# EAGLE design pre (EAGLE 9.3.0)
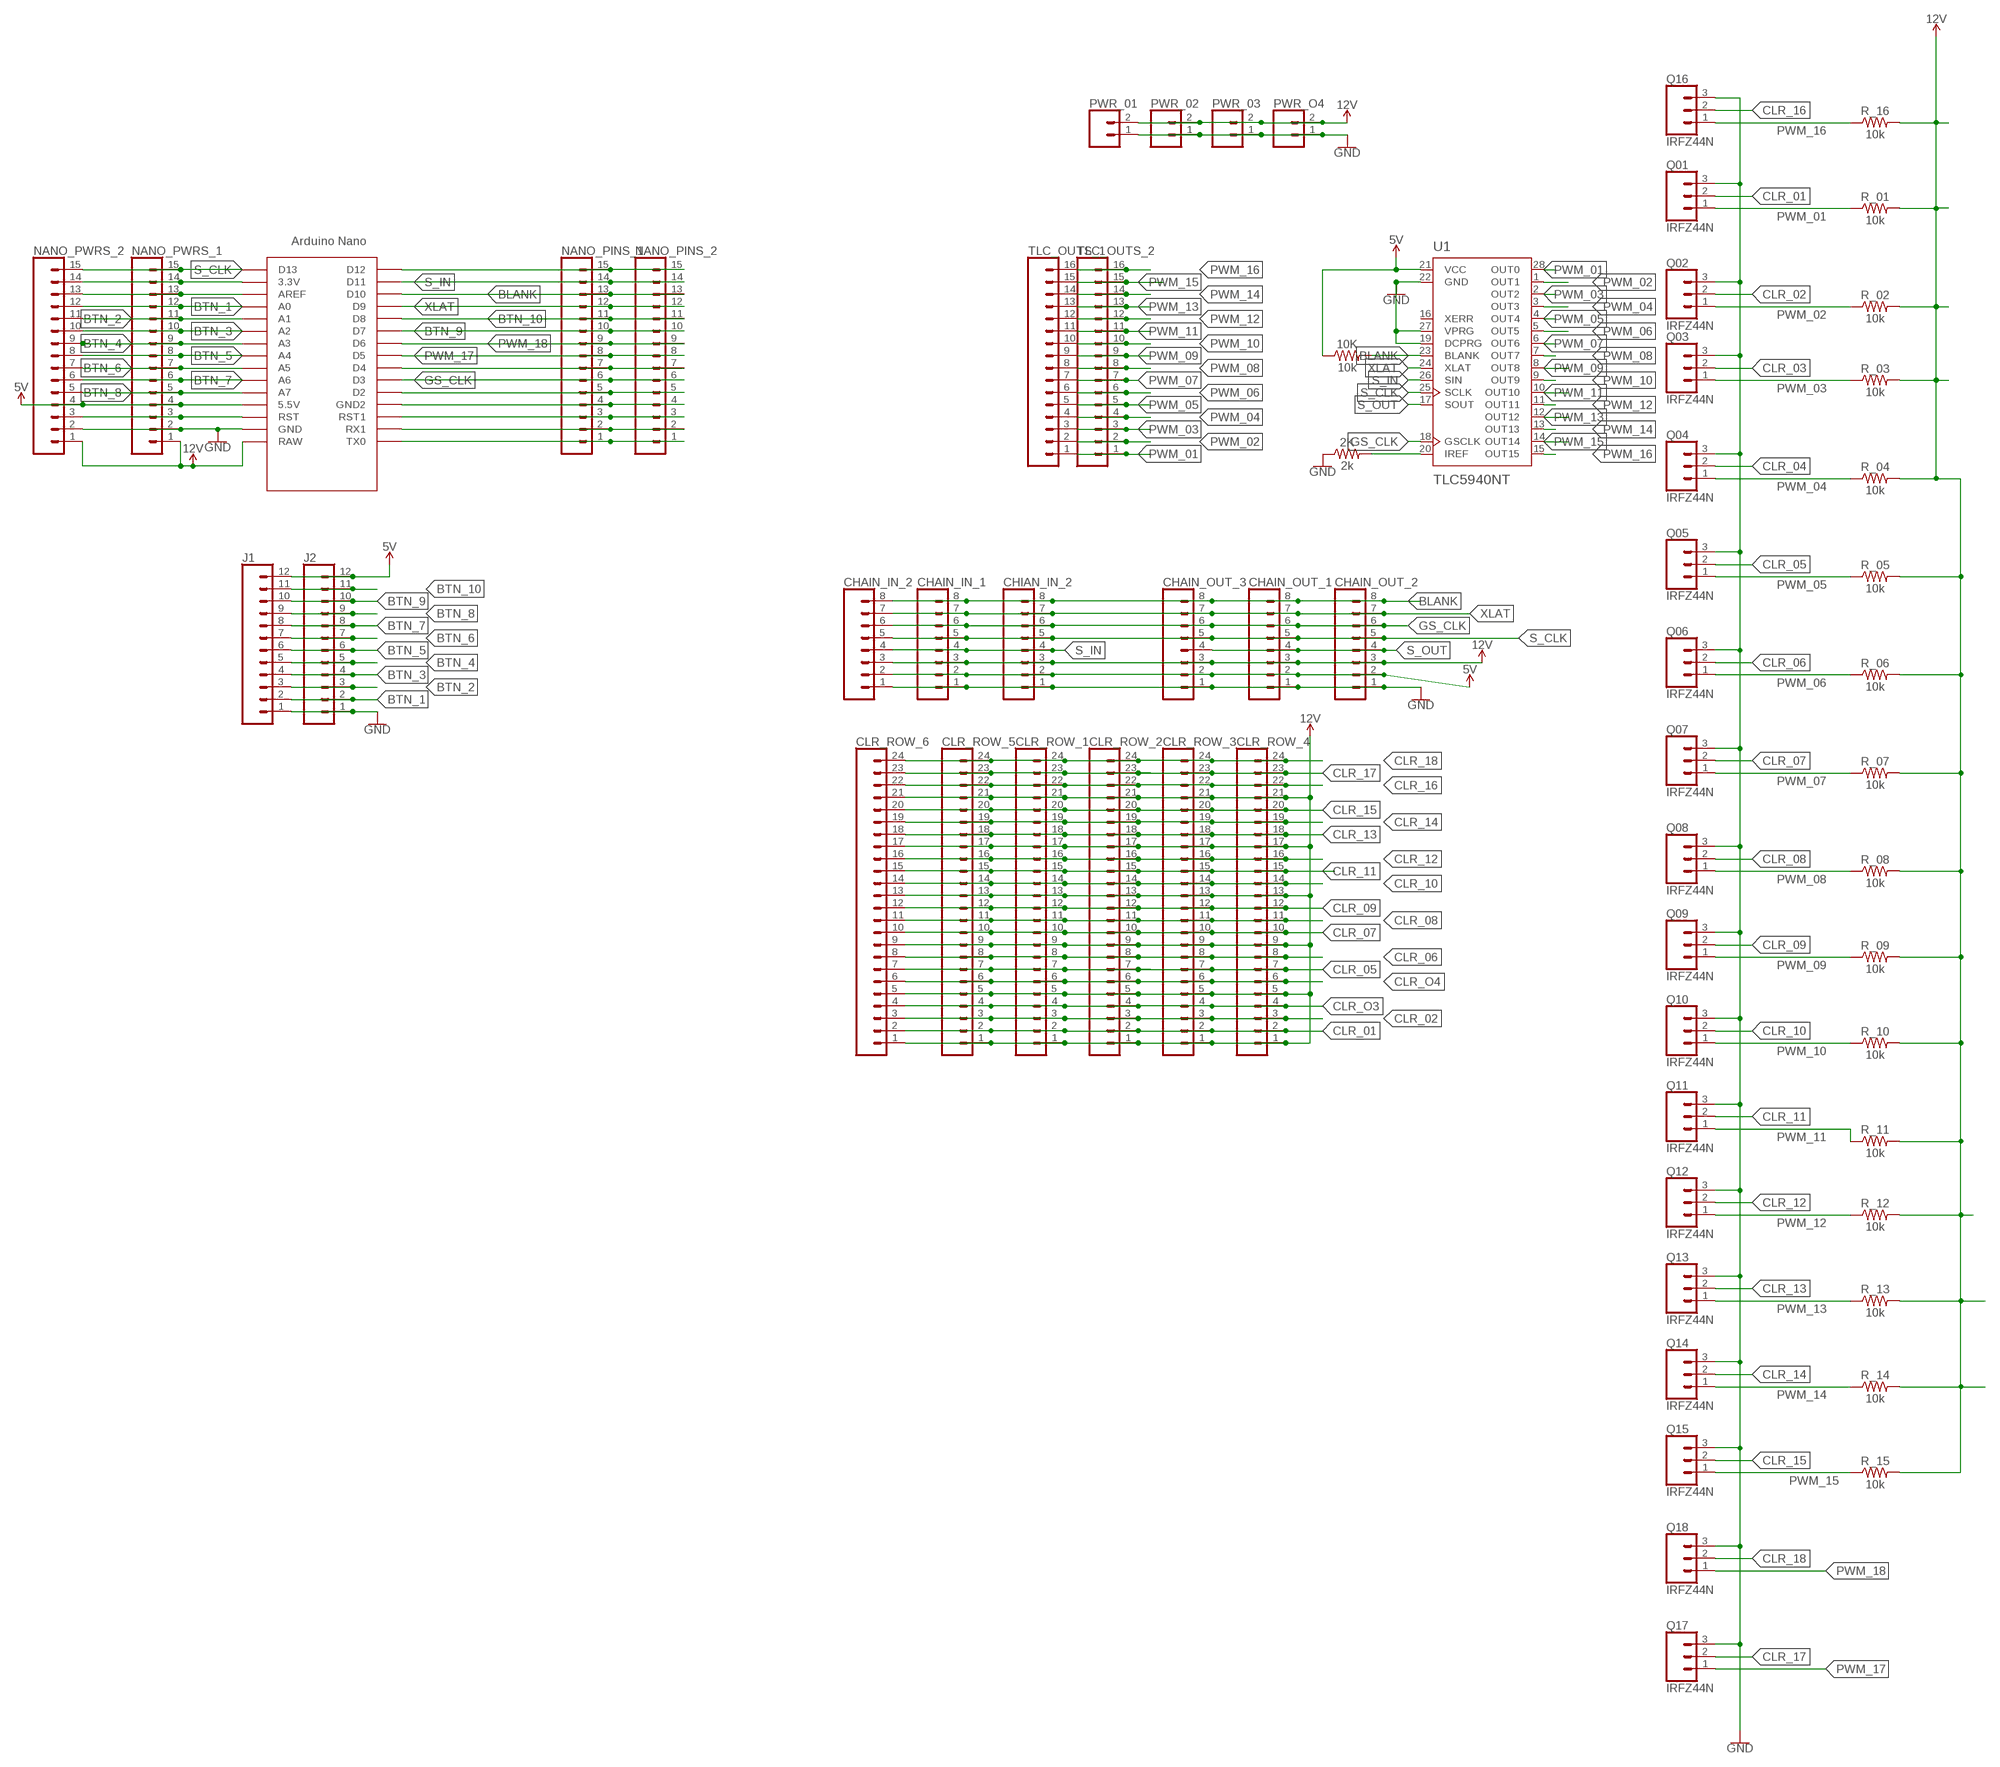
[diagram p0: schematic, sheet 1]

## Parts
2K  2k  10OHM-HORIZ-1/4W-1%  [AXIAL-0.3]
10K  10k  10KOHM-HORIZ-1/4W-1%  [AXIAL-0.3]
CHAIN_IN_1  CONN_08"  [1X08]
CHAIN_IN_2  CONN_08"  [1X08]
CHAIN_OUT_1  CONN_08"  [1X08]
CHAIN_OUT_2  CONN_08"  [1X08]
CHAIN_OUT_3  CONN_08"  [1X08]
CHIAN_IN_2  CONN_08"  [1X08]
CLR_ROW_1  CONN_24  [1X24]
CLR_ROW_2  CONN_24  [1X24]
CLR_ROW_3  CONN_24  [1X24]
CLR_ROW_4  CONN_24  [1X24]
CLR_ROW_5  CONN_24  [1X24]
CLR_ROW_6  CONN_24  [1X24]
J1  CONN_12  [1X12]
J2  CONN_12  [1X12]
NANO_PINS_1  CONN_15  [1X15]
NANO_PINS_2  CONN_15  [1X15]
NANO_PWRS_1  CONN_15  [1X15]
NANO_PWRS_2  CONN_15  [1X15]
PWR_01  CONN_023.5MM  [SCREWTERMINAL-3.5MM-2]
PWR_02  CONN_023.5MM  [SCREWTERMINAL-3.5MM-2]
PWR_03  CONN_02  [1X02]
PWR_O4  CONN_02  [1X02]
Q01  IRFZ44N  CONN_03  [1X03]
Q02  IRFZ44N  CONN_03  [1X03]
Q03  IRFZ44N  CONN_03  [1X03]
Q04  IRFZ44N  CONN_03  [1X03]
Q05  IRFZ44N  CONN_03  [1X03]
Q06  IRFZ44N  CONN_03  [1X03]
Q07  IRFZ44N  CONN_03  [1X03]
Q08  IRFZ44N  CONN_03  [1X03]
Q09  IRFZ44N  CONN_03  [1X03]
Q10  IRFZ44N  CONN_03  [1X03]
Q11  IRFZ44N  CONN_03  [1X03]
Q12  IRFZ44N  CONN_03  [1X03]
Q13  IRFZ44N  CONN_03  [1X03]
Q14  IRFZ44N  CONN_03  [1X03]
Q15  IRFZ44N  CONN_03  [1X03]
Q16  IRFZ44N  CONN_03  [1X03]
Q17  IRFZ44N  CONN_03  [1X03]
Q18  IRFZ44N  CONN_03  [1X03]
R_01  10k  10KOHM-HORIZ-1/4W-1%  [AXIAL-0.3]
R_02  10k  10KOHM-HORIZ-1/4W-1%  [AXIAL-0.3]
R_03  10k  10KOHM-HORIZ-1/4W-1%  [AXIAL-0.3]
R_04  10k  10KOHM-HORIZ-1/4W-1%  [AXIAL-0.3]
R_05  10k  10KOHM-HORIZ-1/4W-1%  [AXIAL-0.3]
R_06  10k  10KOHM-HORIZ-1/4W-1%  [AXIAL-0.3]
R_07  10k  10KOHM-HORIZ-1/4W-1%  [AXIAL-0.3]
R_08  10k  10KOHM-HORIZ-1/4W-1%  [AXIAL-0.3]
R_09  10k  10KOHM-HORIZ-1/4W-1%  [AXIAL-0.3]
R_10  10k  10KOHM-HORIZ-1/4W-1%  [AXIAL-0.3]
R_11  10k  10KOHM-HORIZ-1/4W-1%  [AXIAL-0.3]
R_12  10k  10KOHM-HORIZ-1/4W-1%  [AXIAL-0.3]
R_13  10k  10KOHM-HORIZ-1/4W-1%  [AXIAL-0.3]
R_14  10k  10KOHM-HORIZ-1/4W-1%  [AXIAL-0.3]
R_15  10k  10KOHM-HORIZ-1/4W-1%  [AXIAL-0.3]
R_16  10k  10KOHM-HORIZ-1/4W-1%  [AXIAL-0.3]
TLC_OUTS_1  CONN_16  [1X16]
TLC_OUTS_2  CONN_16  [1X16]
U1  TLC5940NT  [DIL28-3]
U$1  NANO  [NANO]

## Nets
5V: 10K.P$1 CHAIN_IN_1.2 CHAIN_IN_2.2 CHAIN_OUT_1.2 CHAIN_OUT_2.2 CHAIN_OUT_3.2 CHIAN_IN_2.2 J1.12 J2.12 NANO_PWRS_1.4 NANO_PWRS_2.4 U1.21(VCC) U$1.5V(5.5V)
12V: CHAIN_IN_1.3 CHAIN_IN_2.3 CHAIN_OUT_1.3 CHAIN_OUT_2.3 CHAIN_OUT_3.3 CHIAN_IN_2.3 CLR_ROW_1.1 CLR_ROW_1.5 CLR_ROW_1.9 CLR_ROW_1.13 CLR_ROW_1.17 CLR_ROW_1.21 CLR_ROW_2.1 CLR_ROW_2.5 CLR_ROW_2.9 CLR_ROW_2.13 CLR_ROW_2.17 CLR_ROW_2.21 CLR_ROW_3.1 CLR_ROW_3.5 CLR_ROW_3.9 CLR_ROW_3.13 CLR_ROW_3.17 CLR_ROW_3.21 CLR_ROW_4.1 CLR_ROW_4.5 CLR_ROW_4.9 CLR_ROW_4.13 CLR_ROW_4.17 CLR_ROW_4.21 CLR_ROW_5.1 CLR_ROW_5.5 CLR_ROW_5.9 CLR_ROW_5.13 CLR_ROW_5.17 CLR_ROW_5.21 CLR_ROW_6.1 CLR_ROW_6.5 CLR_ROW_6.9 CLR_ROW_6.13 CLR_ROW_6.17 CLR_ROW_6.21 NANO_PWRS_1.1 NANO_PWRS_2.1 PWR_01.2 PWR_02.2 PWR_03.2 PWR_O4.2 R_01.P$2 R_02.P$2 R_03.P$2 R_04.P$2 R_05.P$2 R_06.P$2 R_07.P$2 R_08.P$2 R_09.P$2 R_10.P$2 R_11.P$2 R_12.P$2 R_13.P$2 R_14.P$2 R_15.P$2 R_16.P$2 U$1.RAW
BLANK: 10K.P$2 CHAIN_IN_1.8 CHAIN_IN_2.8 CHAIN_OUT_1.8 CHAIN_OUT_2.8 CHAIN_OUT_3.8 CHIAN_IN_2.8 NANO_PINS_1.13 NANO_PINS_2.13 U1.23(BLANK) U$1.D10
BTN_1: J1.2 J2.2 NANO_PWRS_1.12 NANO_PWRS_2.12 U$1.A0
BTN_2: J1.3 J2.3 NANO_PWRS_1.11 NANO_PWRS_2.11 U$1.A1
BTN_3: J1.4 J2.4 NANO_PWRS_1.10 NANO_PWRS_2.10 U$1.A2
BTN_4: J1.5 J2.5 NANO_PWRS_1.9 NANO_PWRS_2.9 U$1.A3
BTN_5: J1.6 J2.6 NANO_PWRS_1.8 NANO_PWRS_2.8 U$1.A4
BTN_6: J1.7 J2.7 NANO_PWRS_1.7 NANO_PWRS_2.7 U$1.A5
BTN_7: J1.8 J2.8 NANO_PWRS_1.6 NANO_PWRS_2.6 U$1.A6
BTN_8: J1.9 J2.9 NANO_PWRS_1.5 NANO_PWRS_2.5 U$1.A7
BTN_9: J1.10 J2.10 NANO_PINS_1.10 NANO_PINS_2.10 U$1.D7
BTN_10: J1.11 J2.11 NANO_PINS_1.11 NANO_PINS_2.11 U$1.D8
CLR_01: CLR_ROW_1.2 CLR_ROW_2.2 CLR_ROW_3.2 CLR_ROW_4.2 CLR_ROW_5.2 CLR_ROW_6.2 Q01.2
CLR_02: CLR_ROW_1.3 CLR_ROW_2.3 CLR_ROW_3.3 CLR_ROW_4.3 CLR_ROW_5.3 CLR_ROW_6.3 Q02.2
CLR_03: Q03.2
CLR_04: Q04.2
CLR_05: CLR_ROW_1.7 CLR_ROW_2.7 CLR_ROW_3.7 CLR_ROW_4.7 CLR_ROW_5.7 CLR_ROW_6.7 Q05.2
CLR_06: CLR_ROW_1.8 CLR_ROW_2.8 CLR_ROW_3.8 CLR_ROW_4.8 CLR_ROW_5.8 CLR_ROW_6.8 Q06.2
CLR_07: CLR_ROW_1.10 CLR_ROW_2.10 CLR_ROW_3.10 CLR_ROW_4.10 CLR_ROW_5.10 CLR_ROW_6.10 Q07.2
CLR_08: CLR_ROW_1.11 CLR_ROW_2.11 CLR_ROW_3.11 CLR_ROW_4.11 CLR_ROW_5.11 CLR_ROW_6.11 Q08.2
CLR_09: CLR_ROW_1.12 CLR_ROW_2.12 CLR_ROW_3.12 CLR_ROW_4.12 CLR_ROW_5.12 CLR_ROW_6.12 Q09.2
CLR_10: CLR_ROW_1.14 CLR_ROW_2.14 CLR_ROW_3.14 CLR_ROW_4.14 CLR_ROW_5.14 CLR_ROW_6.14 Q10.2
CLR_11: CLR_ROW_1.15 CLR_ROW_2.15 CLR_ROW_3.15 CLR_ROW_4.15 CLR_ROW_5.15 CLR_ROW_6.15 Q11.2
CLR_12: CLR_ROW_1.16 CLR_ROW_2.16 CLR_ROW_3.16 CLR_ROW_4.16 CLR_ROW_5.16 CLR_ROW_6.16 Q12.2
CLR_13: CLR_ROW_1.18 CLR_ROW_2.18 CLR_ROW_3.18 CLR_ROW_4.18 CLR_ROW_5.18 CLR_ROW_6.18 Q13.2
CLR_14: CLR_ROW_1.19 CLR_ROW_2.19 CLR_ROW_3.19 CLR_ROW_4.19 CLR_ROW_5.19 CLR_ROW_6.19 Q14.2
CLR_15: CLR_ROW_1.20 CLR_ROW_2.20 CLR_ROW_3.20 CLR_ROW_4.20 CLR_ROW_5.20 CLR_ROW_6.20 Q15.2
CLR_16: CLR_ROW_1.22 CLR_ROW_2.22 CLR_ROW_3.22 CLR_ROW_4.22 CLR_ROW_5.22 CLR_ROW_6.22 Q16.2
CLR_17: CLR_ROW_1.23 CLR_ROW_2.23 CLR_ROW_3.23 CLR_ROW_4.23 CLR_ROW_5.23 CLR_ROW_6.23 Q17.2
CLR_18: CLR_ROW_1.24 CLR_ROW_2.24 CLR_ROW_3.24 CLR_ROW_4.24 CLR_ROW_5.24 CLR_ROW_6.24 Q18.2
CLR_O3: CLR_ROW_1.4 CLR_ROW_2.4 CLR_ROW_3.4 CLR_ROW_4.4 CLR_ROW_5.4 CLR_ROW_6.4
CLR_O4: CLR_ROW_1.6 CLR_ROW_2.6 CLR_ROW_3.6 CLR_ROW_4.6 CLR_ROW_5.6 CLR_ROW_6.6
GND: 2K.P$1 CHAIN_IN_1.1 CHAIN_IN_2.1 CHAIN_OUT_1.1 CHAIN_OUT_2.1 CHAIN_OUT_3.1 CHIAN_IN_2.1 J1.1 J2.1 NANO_PINS_1.4 NANO_PINS_2.4 NANO_PWRS_1.2 NANO_PWRS_2.2 PWR_01.1 PWR_02.1 PWR_03.1 PWR_O4.1 Q01.3 Q02.3 Q03.3 Q04.3 Q05.3 Q06.3 Q07.3 Q08.3 Q09.3 Q10.3 Q11.3 Q12.3 Q13.3 Q14.3 Q15.3 Q16.3 Q17.3 Q18.3 U1.19(DCPRG) U1.22(GND) U1.27(VPRG) U$1.GND U$1.GND1(GND2)
GS_CLK: CHAIN_IN_1.6 CHAIN_IN_2.6 CHAIN_OUT_1.6 CHAIN_OUT_2.6 CHAIN_OUT_3.6 CHIAN_IN_2.6 NANO_PINS_1.6 NANO_PINS_2.6 U1.18(GSCLK) U$1.D3
N$1: 2K.P$2 U1.20(IREF)
N$3: NANO_PWRS_1.14 NANO_PWRS_2.14 U$1.3.3V
N$4: NANO_PWRS_1.13 NANO_PWRS_2.13 U$1.AREF
N$13: NANO_PWRS_1.3 NANO_PWRS_2.3 U$1.RST
N$14: NANO_PINS_1.15 NANO_PINS_2.15 U$1.D12
N$16: NANO_PINS_1.3 NANO_PINS_2.3 U$1.RST1
N$19: NANO_PINS_1.2 NANO_PINS_2.2 U$1.RX1
N$20: NANO_PINS_1.7 NANO_PINS_2.7 U$1.D4
N$21: NANO_PINS_1.1 NANO_PINS_2.1 U$1.TX0
N$22: NANO_PINS_1.5 NANO_PINS_2.5 U$1.D2
PWM_01: Q01.1 R_01.P$1 TLC_OUTS_1.1 TLC_OUTS_2.1 U1.28(OUT0)
PWM_02: Q02.1 R_02.P$1 TLC_OUTS_1.2 TLC_OUTS_2.2 U1.1(OUT1)
PWM_03: Q03.1 R_03.P$1 TLC_OUTS_1.3 TLC_OUTS_2.3 U1.2(OUT2)
PWM_04: Q04.1 R_04.P$1 TLC_OUTS_1.4 TLC_OUTS_2.4 U1.3(OUT3)
PWM_05: Q05.1 R_05.P$1 TLC_OUTS_1.5 TLC_OUTS_2.5 U1.4(OUT4)
PWM_06: Q06.1 R_06.P$1 TLC_OUTS_1.6 TLC_OUTS_2.6 U1.5(OUT5)
PWM_07: Q07.1 R_07.P$1 TLC_OUTS_1.7 TLC_OUTS_2.7 U1.6(OUT6)
PWM_08: Q08.1 R_08.P$1 TLC_OUTS_1.8 TLC_OUTS_2.8 U1.7(OUT7)
PWM_09: Q09.1 R_09.P$1 TLC_OUTS_1.9 TLC_OUTS_2.9 U1.8(OUT8)
PWM_10: Q10.1 R_10.P$1 TLC_OUTS_1.10 TLC_OUTS_2.10 U1.9(OUT9)
PWM_11: Q11.1 R_11.P$1 TLC_OUTS_1.11 TLC_OUTS_2.11 U1.10(OUT10)
PWM_12: Q12.1 R_12.P$1 TLC_OUTS_1.12 TLC_OUTS_2.12 U1.11(OUT11)
PWM_13: Q13.1 R_13.P$1 TLC_OUTS_1.13 TLC_OUTS_2.13 U1.12(OUT12)
PWM_14: Q14.1 R_14.P$1 TLC_OUTS_1.14 TLC_OUTS_2.14 U1.13(OUT13)
PWM_15: Q15.1 R_15.P$1 TLC_OUTS_1.15 TLC_OUTS_2.15 U1.14(OUT14)
PWM_16: Q16.1 R_16.P$1 TLC_OUTS_1.16 TLC_OUTS_2.16 U1.15(OUT15)
PWM_17: NANO_PINS_1.8 NANO_PINS_2.8 Q17.1 U$1.D5
PWM_18: NANO_PINS_1.9 NANO_PINS_2.9 Q18.1 U$1.D6
S_CLK: CHAIN_IN_1.5 CHAIN_IN_2.5 CHAIN_OUT_1.5 CHAIN_OUT_2.5 CHAIN_OUT_3.5 CHIAN_IN_2.5 NANO_PWRS_1.15 NANO_PWRS_2.15 U1.25(SCLK) U$1.D13
S_IN: CHAIN_IN_1.4 CHAIN_IN_2.4 CHIAN_IN_2.4 NANO_PINS_1.14 NANO_PINS_2.14 U1.26(SIN) U$1.D11
S_OUT: CHAIN_OUT_1.4 CHAIN_OUT_2.4 CHAIN_OUT_3.4 U1.17(SOUT)
XLAT: CHAIN_IN_1.7 CHAIN_IN_2.7 CHAIN_OUT_1.7 CHAIN_OUT_2.7 CHAIN_OUT_3.7 CHIAN_IN_2.7 NANO_PINS_1.12 NANO_PINS_2.12 U1.24(XLAT) U$1.D9
Unconnected: U1.16(XERR) U$1.ICSP1 U$1.ICSP2 U$1.ICSP3 U$1.ICSP4 U$1.ICSP5 U$1.ICSP6

## Library data of the parts
2K = SparkFun-Resistors:10OHM: 10Ω resistor A resistor is a passive two-terminal electrical component that implements electrical resistance as a circuit element. Resistors act to reduce current flow, and, at the same time, act to lower voltage levels within circuits. - Wikipedia; PROD_ID: RES-12180; VALUE: 10
10K R_01-R_09 R_10-R_16 = SparkFun-Resistors:10KOHM: 10kΩ resistor A resistor is a passive two-terminal electrical component that implements electrical resistance as a circuit element. Resistors act to reduce current flow, and, at the same time, act to lower voltage levels within circuits. - Wikipedia; PROD_ID: RES-12183
CHAIN_IN_1 CHAIN_IN_2 CHAIN_OUT_1-CHAIN_OUT_3 CHIAN_IN_2 = SparkFun-Connectors:CONN_08: Multi connection point. Often used as Generic Header-pin footprint for 0.1 inch spaced/style header connections On any of the 0.1 inch spaced packages, you can populate with these: Break Away Headers - Straight <https://www.sparkfun.com/products/116> (PRT-00116) Break Away Male Headers - Right Angle <https://www.sparkfun.com/products/553> (PRT-00553) Female Headers <https://www.sparkfun.com/products/115> (PRT-00115) Break Away Headers - Machine Pin <https://www.sparkfun.com/products/117> (PRT-00117) Break Away Female Headers - Swiss Machine Pin <https://www.sparkfun.com/products/743> (PRT-00743) Arduino Stackable Header - 8 Pin <https://www.sparkfun.com/products/9279> (PRT-09279) For SCREWTERMINALS and SPRING TERMINALS visit here: Screw Terimnals on SparkFun.com <https://www.sparkfun.com/search/results?term=Screw+Terminals> (5mm/3.5mm/2.54mm spacing) This device is also useful as a general connection point to wire up your design to another part of your project. Our various solder wires solder well into these plated through hole pads. Hook-Up Wire - Assortment (Stranded, 22 AWG) <https://www.sparkfun.com/products/11375> (PRT-11375) Hook-Up Wire - Assortment (Solid Core, 22 AWG) <https://www.sparkfun.com/products/11367> (PRT-11367) View the entire wire category on our website here <https://www.sparkfun.com/categories/141> Special notes: Molex polarized connector foot print use with SKU : PRT-08231 with associated crimp pins and housings. 1MM SMD Version SKU: PRT-10208 NOTES ON THE VARIANTS LOCK and LOCK_LONGPADS... This footprint was designed to help hold the alignment of a through-hole component (i.e. 6-pin header) while soldering it into place. You may notice that each hole has been shifted either up or down by 0.005 of an inch from it's more standard position (which is a perfectly straight line). This slight alteration caused the pins (the squares in the middle) to touch the edges of the holes. Because they are alternating, it causes a "brace" to hold the component in place. 0.005 has proven to be the perfect amount of "off-center" position when using our standard breakaway headers. Although looks a little odd when you look at the bare footprint, once you have a header in there, the alteration is very hard to notice. Also,if you push a header all the way into place, it is covered up entirely on the bottom side.; PROD_ID: CONN-08438
CLR_ROW_1-CLR_ROW_6 = SparkFun-Connectors:CONN_24: Multi connection point. Often used as Generic Header-pin footprint for 0.1 inch spaced/style header connections On any of the 0.1 inch spaced packages, you can populate with these: Break Away Headers - Straight <https://www.sparkfun.com/products/116> (PRT-00116) Break Away Male Headers - Right Angle <https://www.sparkfun.com/products/553> (PRT-00553) Female Headers <https://www.sparkfun.com/products/115> (PRT-00115) Break Away Headers - Machine Pin <https://www.sparkfun.com/products/117> (PRT-00117) Break Away Female Headers - Swiss Machine Pin <https://www.sparkfun.com/products/743> (PRT-00743) For SCREWTERMINALS and SPRING TERMINALS visit here: Screw Terimnals on SparkFun.com <https://www.sparkfun.com/search/results?term=Screw+Terminals> (5mm/3.5mm/2.54mm spacing) This device is also useful as a general connection point to wire up your design to another part of your project. Our various solder wires solder well into these plated through hole pads. Hook-Up Wire - Assortment (Stranded, 22 AWG) <https://www.sparkfun.com/products/11375> (PRT-11375) Hook-Up Wire - Assortment (Solid Core, 22 AWG) <https://www.sparkfun.com/products/11367> (PRT-11367) View the entire wire category on our website here <https://www.sparkfun.com/categories/141> Special notes: Molex polarized connector foot print use with SKU : PRT-08231 with associated crimp pins and housings. 1MM SMD Version SKU: PRT-10208 NOTES ON THE VARIANTS LOCK and LOCK_LONGPADS... This footprint was designed to help hold the alignment of a through-hole component (i.e. 6-pin header) while soldering it into place. You may notice that each hole has been shifted either up or down by 0.005 of an inch from it's more standard position (which is a perfectly straight line). This slight alteration caused the pins (the squares in the middle) to touch the edges of the holes. Because they are alternating, it causes a "brace" to hold the component in place. 0.005 has proven to be the perfect amount of "off-center" position when using our standard breakaway headers. Although looks a little odd when you look at the bare footprint, once you have a header in there, the alteration is very hard to notice. Also,if you push a header all the way into place, it is covered up entirely on the bottom side.
J1 J2 = SparkFun-Connectors:CONN_12: Multi connection point. Often used as Generic Header-pin footprint for 0.1 inch spaced/style header connections On any of the 0.1 inch spaced packages, you can populate with these: Break Away Headers - Straight <https://www.sparkfun.com/products/116> (PRT-00116) Break Away Male Headers - Right Angle <https://www.sparkfun.com/products/553> (PRT-00553) Female Headers <https://www.sparkfun.com/products/115> (PRT-00115) Break Away Headers - Machine Pin <https://www.sparkfun.com/products/117> (PRT-00117) Break Away Female Headers - Swiss Machine Pin <https://www.sparkfun.com/products/743> (PRT-00743) For SCREWTERMINALS and SPRING TERMINALS visit here: Screw Terimnals on SparkFun.com <https://www.sparkfun.com/search/results?term=Screw+Terminals> (5mm/3.5mm/2.54mm spacing) This device is also useful as a general connection point to wire up your design to another part of your project. Our various solder wires solder well into these plated through hole pads. Hook-Up Wire - Assortment (Stranded, 22 AWG) <https://www.sparkfun.com/products/11375> (PRT-11375) Hook-Up Wire - Assortment (Solid Core, 22 AWG) <https://www.sparkfun.com/products/11367> (PRT-11367) View the entire wire category on our website here <https://www.sparkfun.com/categories/141> Special notes: Molex polarized connector foot print use with SKU : PRT-08231 with associated crimp pins and housings. 1MM SMD Version SKU: PRT-10208 NOTES ON THE VARIANTS LOCK and LOCK_LONGPADS... This footprint was designed to help hold the alignment of a through-hole component (i.e. 6-pin header) while soldering it into place. You may notice that each hole has been shifted either up or down by 0.005 of an inch from it's more standard position (which is a perfectly straight line). This slight alteration caused the pins (the squares in the middle) to touch the edges of the holes. Because they are alternating, it causes a "brace" to hold the component in place. 0.005 has proven to be the perfect amount of "off-center" position when using our standard breakaway headers. Although looks a little odd when you look at the bare footprint, once you have a header in there, the alteration is very hard to notice. Also,if you push a header all the way into place, it is covered up entirely on the bottom side.
NANO_PINS_1 NANO_PINS_2 NANO_PWRS_1 NANO_PWRS_2 = SparkFun-Connectors:CONN_15: Multi connection point. Often used as Generic Header-pin footprint for 0.1 inch spaced/style header connections On any of the 0.1 inch spaced packages, you can populate with these: Break Away Headers - Straight <https://www.sparkfun.com/products/116> (PRT-00116) Break Away Male Headers - Right Angle <https://www.sparkfun.com/products/553> (PRT-00553) Female Headers <https://www.sparkfun.com/products/115> (PRT-00115) Break Away Headers - Machine Pin <https://www.sparkfun.com/products/117> (PRT-00117) Break Away Female Headers - Swiss Machine Pin <https://www.sparkfun.com/products/743> (PRT-00743) For SCREWTERMINALS and SPRING TERMINALS visit here: Screw Terimnals on SparkFun.com <https://www.sparkfun.com/search/results?term=Screw+Terminals> (5mm/3.5mm/2.54mm spacing) This device is also useful as a general connection point to wire up your design to another part of your project. Our various solder wires solder well into these plated through hole pads. Hook-Up Wire - Assortment (Stranded, 22 AWG) <https://www.sparkfun.com/products/11375> (PRT-11375) Hook-Up Wire - Assortment (Solid Core, 22 AWG) <https://www.sparkfun.com/products/11367> (PRT-11367) View the entire wire category on our website here <https://www.sparkfun.com/categories/141> Special notes: Molex polarized connector foot print use with SKU : PRT-08231 with associated crimp pins and housings. 1MM SMD Version SKU: PRT-10208 NOTES ON THE VARIANTS LOCK and LOCK_LONGPADS... This footprint was designed to help hold the alignment of a through-hole component (i.e. 6-pin header) while soldering it into place. You may notice that each hole has been shifted either up or down by 0.005 of an inch from it's more standard position (which is a perfectly straight line). This slight alteration caused the pins (the squares in the middle) to touch the edges of the holes. Because they are alternating, it causes a "brace" to hold the component in place. 0.005 has proven to be the perfect amount of "off-center" position when using our standard breakaway headers. Although looks a little odd when you look at the bare footprint, once you have a header in there, the alteration is very hard to notice. Also,if you push a header all the way into place, it is covered up entirely on the bottom side.
PWR_01 PWR_02 = SparkFun-Connectors:CONN_02: Multi connection point. Often used as Generic Header-pin footprint for 0.1 inch spaced/style header connections On any of the 0.1 inch spaced packages, you can populate with these: Break Away Headers - Straight <https://www.sparkfun.com/products/116> (PRT-00116) Break Away Male Headers - Right Angle <https://www.sparkfun.com/products/553> (PRT-00553) Female Headers <https://www.sparkfun.com/products/115> (PRT-00115) Break Away Headers - Machine Pin <https://www.sparkfun.com/products/117> (PRT-00117) Break Away Female Headers - Swiss Machine Pin <https://www.sparkfun.com/products/743> (PRT-00743) For SCREWTERMINALS and SPRING TERMINALS visit here: Screw Terimnals on SparkFun.com <https://www.sparkfun.com/search/results?term=Screw+Terminals> (5mm/3.5mm/2.54mm spacing) This device is also useful as a general connection point to wire up your design to another part of your project. Our various solder wires solder well into these plated through hole pads. Hook-Up Wire - Assortment (Stranded, 22 AWG) <https://www.sparkfun.com/products/11375> (PRT-11375) Hook-Up Wire - Assortment (Solid Core, 22 AWG) <https://www.sparkfun.com/products/11367> (PRT-11367) View the entire wire category on our website here <https://www.sparkfun.com/categories/141> Special notes: Molex polarized connector foot print use with: PRT-08233 with associated crimp pins and housings. 2.54_SCREWTERM for use with PRT-10571. 3.5mm Screw Terminal footprints for PRT-08084 5mm Screw Terminal footprints for use with PRT-08432; PROD_ID: CONN-08399
PWR_03 PWR_O4 = SparkFun-Connectors:CONN_02: Multi connection point. Often used as Generic Header-pin footprint for 0.1 inch spaced/style header connections On any of the 0.1 inch spaced packages, you can populate with these: Break Away Headers - Straight <https://www.sparkfun.com/products/116> (PRT-00116) Break Away Male Headers - Right Angle <https://www.sparkfun.com/products/553> (PRT-00553) Female Headers <https://www.sparkfun.com/products/115> (PRT-00115) Break Away Headers - Machine Pin <https://www.sparkfun.com/products/117> (PRT-00117) Break Away Female Headers - Swiss Machine Pin <https://www.sparkfun.com/products/743> (PRT-00743) For SCREWTERMINALS and SPRING TERMINALS visit here: Screw Terimnals on SparkFun.com <https://www.sparkfun.com/search/results?term=Screw+Terminals> (5mm/3.5mm/2.54mm spacing) This device is also useful as a general connection point to wire up your design to another part of your project. Our various solder wires solder well into these plated through hole pads. Hook-Up Wire - Assortment (Stranded, 22 AWG) <https://www.sparkfun.com/products/11375> (PRT-11375) Hook-Up Wire - Assortment (Solid Core, 22 AWG) <https://www.sparkfun.com/products/11367> (PRT-11367) View the entire wire category on our website here <https://www.sparkfun.com/categories/141> Special notes: Molex polarized connector foot print use with: PRT-08233 with associated crimp pins and housings. 2.54_SCREWTERM for use with PRT-10571. 3.5mm Screw Terminal footprints for PRT-08084 5mm Screw Terminal footprints for use with PRT-08432
Q01-Q09 Q10-Q18 = SparkFun-Connectors:CONN_03: Multi connection point. Often used as Generic Header-pin footprint for 0.1 inch spaced/style header connections On any of the 0.1 inch spaced packages, you can populate with these: Break Away Headers - Straight <https://www.sparkfun.com/products/116> (PRT-00116) Break Away Male Headers - Right Angle <https://www.sparkfun.com/products/553> (PRT-00553) Female Headers <https://www.sparkfun.com/products/115> (PRT-00115) Break Away Headers - Machine Pin <https://www.sparkfun.com/products/117> (PRT-00117) Break Away Female Headers - Swiss Machine Pin <https://www.sparkfun.com/products/743> (PRT-00743) Stackable Header - 3 Pin (Female, 0.1") <https://www.sparkfun.com/products/13875> (PRT-13875) For SCREWTERMINALS and SPRING TERMINALS visit here: Screw Terimnals on SparkFun.com <https://www.sparkfun.com/search/results?term=Screw+Terminals> (5mm/3.5mm/2.54mm spacing) This device is also useful as a general connection point to wire up your design to another part of your project. Our various solder wires solder well into these plated through hole pads. Hook-Up Wire - Assortment (Stranded, 22 AWG) <https://www.sparkfun.com/products/11375> (PRT-11375) Hook-Up Wire - Assortment (Solid Core, 22 AWG) <https://www.sparkfun.com/products/11367> (PRT-11367) View the entire wire category on our website here <https://www.sparkfun.com/categories/141> Special notes: Molex polarized connector foot print use with SKU : PRT-08232 with associated crimp pins and housings.; PROD_ID: XXX-00000; VALUE: 455-1750-1-ND
TLC_OUTS_1 TLC_OUTS_2 = SparkFun-Connectors:CONN_16: Multi connection point. Often used as Generic Header-pin footprint for 0.1 inch spaced/style header connections On any of the 0.1 inch spaced packages, you can populate with these: Break Away Headers - Straight <https://www.sparkfun.com/products/116> (PRT-00116) Break Away Male Headers - Right Angle <https://www.sparkfun.com/products/553> (PRT-00553) Female Headers <https://www.sparkfun.com/products/115> (PRT-00115) Break Away Headers - Machine Pin <https://www.sparkfun.com/products/117> (PRT-00117) Break Away Female Headers - Swiss Machine Pin <https://www.sparkfun.com/products/743> (PRT-00743) For SCREWTERMINALS and SPRING TERMINALS visit here: Screw Terimnals on SparkFun.com <https://www.sparkfun.com/search/results?term=Screw+Terminals> (5mm/3.5mm/2.54mm spacing) This device is also useful as a general connection point to wire up your design to another part of your project. Our various solder wires solder well into these plated through hole pads. Hook-Up Wire - Assortment (Stranded, 22 AWG) <https://www.sparkfun.com/products/11375> (PRT-11375) Hook-Up Wire - Assortment (Solid Core, 22 AWG) <https://www.sparkfun.com/products/11367> (PRT-11367) View the entire wire category on our website here <https://www.sparkfun.com/categories/141> Special notes: Molex polarized connector foot print use with SKU : PRT-08231 with associated crimp pins and housings. 1MM SMD Version SKU: PRT-10208 NOTES ON THE VARIANTS LOCK and LOCK_LONGPADS... This footprint was designed to help hold the alignment of a through-hole component (i.e. 6-pin header) while soldering it into place. You may notice that each hole has been shifted either up or down by 0.005 of an inch from it's more standard position (which is a perfectly straight line). This slight alteration caused the pins (the squares in the middle) to touch the edges of the holes. Because they are alternating, it causes a "brace" to hold the component in place. 0.005 has proven to be the perfect amount of "off-center" position when using our standard breakaway headers. Although looks a little odd when you look at the bare footprint, once you have a header in there, the alteration is very hard to notice. Also,if you push a header all the way into place, it is covered up entirely on the bottom side.
U1 = tlc5940:TLC5940
U$1 = Arduino-clone:NANO: Arduino Nano

## Board
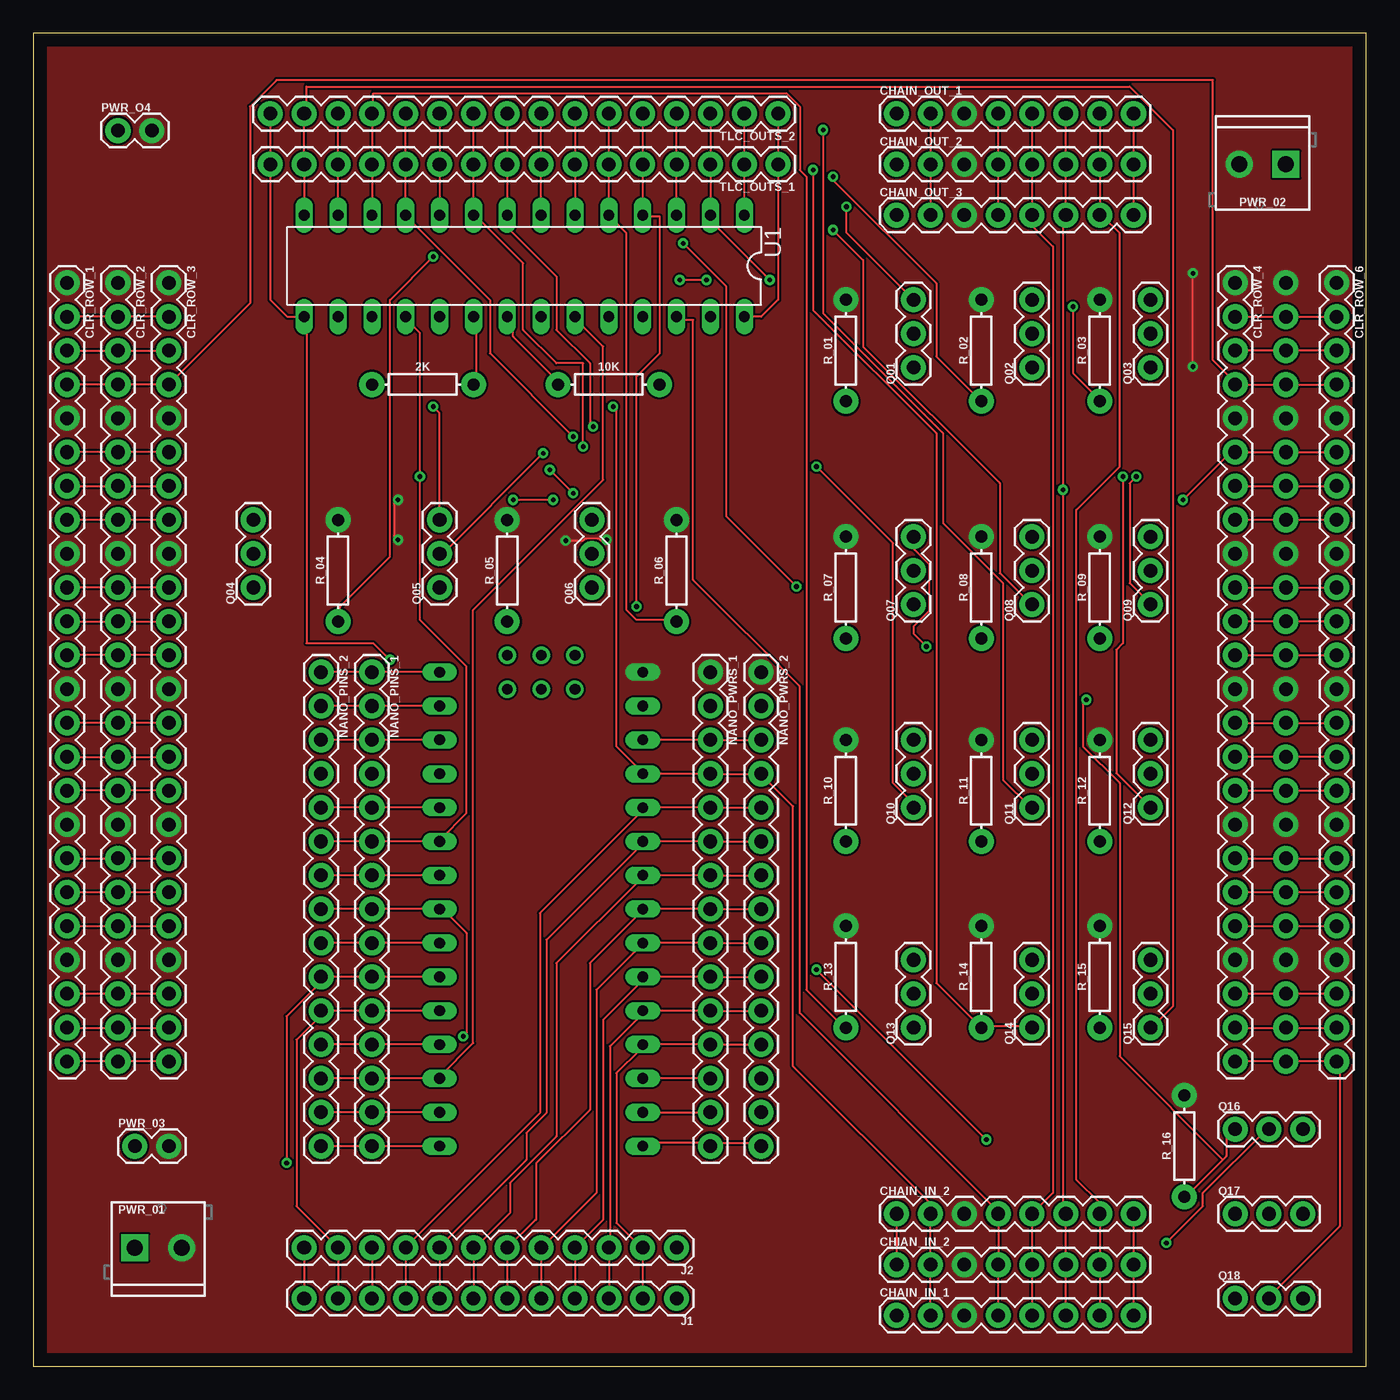
[diagram p1: board, top side]
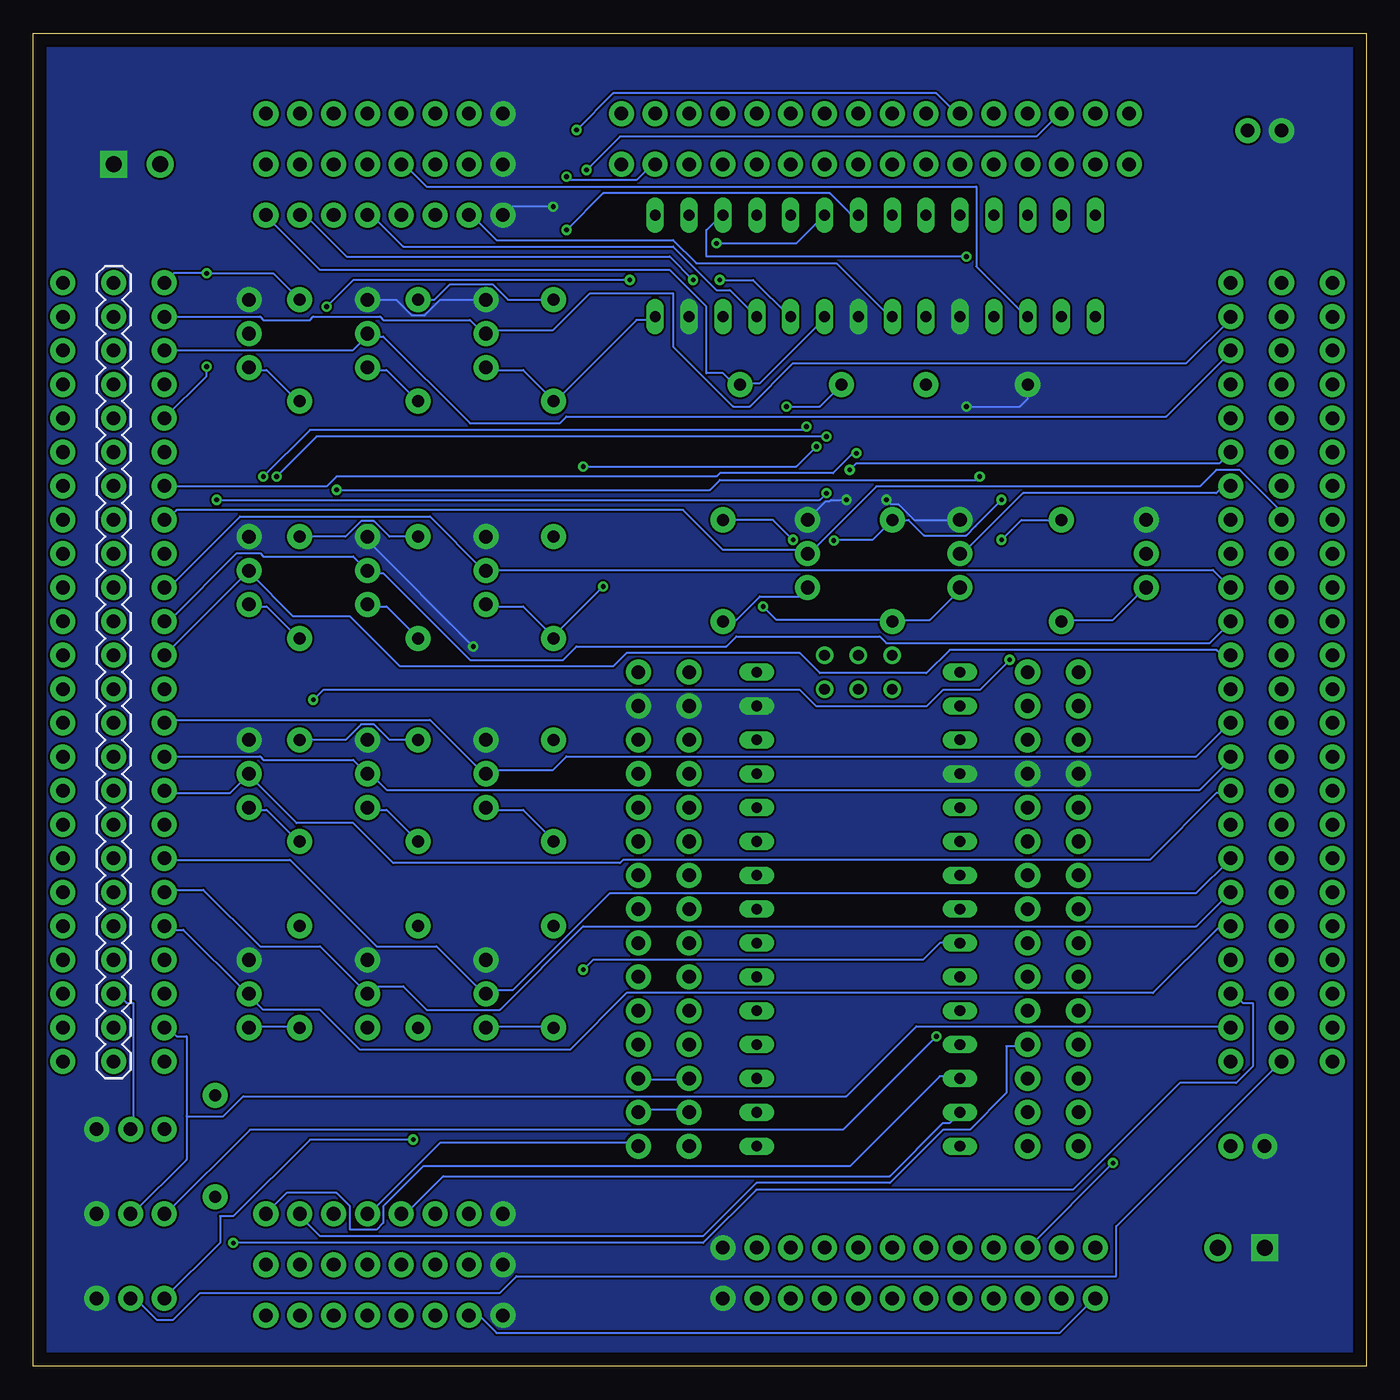
[diagram p2: board, bottom side, seen from below]

Size 100 x 100 mm. Coordinates in mm from the lower left corner, seen from the top.
Outline: 0,0 100,0 100,100 0,100 0,0
Copper layers (1*16): Top 0.035mm / dielectric 1.5mm / Bottom 0.035mm
Design rules "default": minimum track width 6mil, minimum drill 0.35mm, track to track 6mil, track to pad 6mil, pad to pad 6mil, via to via 6mil, smd to smd 6mil, copper to edge 40mil, drill to drill 6mil, minimum pad ring 10mil, minimum via ring 8mil, stop-mask expansion 4mil, vias tented up to drill 0mil, thermal gap 10mil

### Footprints (pad centres in the part's own frame; a part is rotated, then mirrored left to right if it is on the bottom)
AXIAL-0.3 = drill 0.9 pad 1.88: P$1 -3.81,0; P$2 3.81,0
1X08 = drill 1.016 pad 1.88: 1 0,0; 2 2.54,0; 3 5.08,0; 4 7.62,0; 5 10.16,0; 6 12.7,0; 7 15.24,0; 8 17.78,0
1X24 = drill 1.016 pad 1.88: 1 -26.67,0; 2 -24.13,0; 3 -21.59,0; 4 -19.05,0; 5 -16.51,0; 6 -13.97,0; 7 -11.43,0; 8 -8.89,0; 9 -6.35,0; 10 -3.81,0; 11 -1.27,0; 12 1.27,0; 13 3.81,0; 14 6.35,0; 15 8.89,0; 16 11.43,0; 17 13.97,0; 18 16.51,0; 19 19.05,0; 20 21.59,0; 21 24.13,0; 22 26.67,0; 23 29.21,0; 24 31.75,0
1X12 = drill 1.016 pad 1.88: 1 0,0; 2 2.54,0; 3 5.08,0; 4 7.62,0; 5 10.16,0; 6 12.7,0; 7 15.24,0; 8 17.78,0; 9 20.32,0; 10 22.86,0; 11 25.4,0; 12 27.94,0
1X15 = drill 1.016 pad 1.88: 1 0,0; 2 2.54,0; 3 5.08,0; 4 7.62,0; 5 10.16,0; 6 12.7,0; 7 15.24,0; 8 17.78,0; 9 20.32,0; 10 22.86,0; 11 25.4,0; 12 27.94,0; 13 30.48,0; 14 33.02,0; 15 35.56,0
SCREWTERMINAL-3.5MM-2 = drill 1.2 pad 2.032 square: 1 0,0 | drill 1.2 pad 2.032: 2 3.5,0
1X02 = drill 1.016 pad 1.88: 1 0,0; 2 2.54,0
1X03 = drill 1.016 pad 1.88: 1 0,0; 2 2.54,0; 3 5.08,0
1X16 = drill 1.016 pad 1.88: 1 0,0; 2 2.54,0; 3 5.08,0; 4 7.62,0; 5 10.16,0; 6 12.7,0; 7 15.24,0; 8 17.78,0; 9 20.32,0; 10 22.86,0; 11 25.4,0; 12 27.94,0; 13 30.48,0; 14 33.02,0; 15 35.56,0; 16 38.1,0
DIL28-3 = drill 0.813 long: 1 -16.51,-3.81; 2 -13.97,-3.81; 3 -11.43,-3.81; 4 -8.89,-3.81; 5 -6.35,-3.81; 6 -3.81,-3.81; 7 -1.27,-3.81; 8 1.27,-3.81; 9 3.81,-3.81; 10 6.35,-3.81; 11 8.89,-3.81; 12 11.43,-3.81; 13 13.97,-3.81; 14 16.51,-3.81; 15 16.51,3.81; 16 13.97,3.81; 17 11.43,3.81; 18 8.89,3.81; 19 6.35,3.81; 20 3.81,3.81; 21 1.27,3.81; 22 -1.27,3.81; 23 -3.81,3.81; 24 -6.35,3.81; 25 -8.89,3.81; 26 -11.43,3.81; 27 -13.97,3.81; 28 -16.51,3.81
NANO = drill 0.8 long: 3.3V -10.16,24.13; 5V -10.16,-1.27; A0 -10.16,19.05; A1 -10.16,16.51; A2 -10.16,13.97; A3 -10.16,11.43; A4 -10.16,8.89; A5 -10.16,6.35; A6 -10.16,3.81; A7 -10.16,1.27; AREF -10.16,21.59; D2 5.08,1.27; D3 5.08,3.81; D4 5.08,6.35; D5 5.08,8.89; D6 5.08,11.43; D7 5.08,13.97; D8 5.08,16.51; D9 5.08,19.05; D10 5.08,21.59; D11 5.08,24.13; D12 5.08,26.67; D13 -10.16,26.67; GND -10.16,-6.35; GND1 5.08,-1.27; RAW -10.16,-8.89; RST -10.16,-3.81; RST1 5.08,-3.81; RX1 5.08,-6.35; TX0 5.08,-8.89 | drill 0.8: ICSP1 -5.08,-10.16; ICSP2 -5.08,-7.62; ICSP3 -2.54,-10.16; ICSP4 -2.54,-7.62; ICSP5 0,-10.16; ICSP6 0,-7.62

### Placement (x,y rotation side)
2K  29.21,73.66 0 top
10K  43.18,73.66 0 top
CHAIN_IN_1  64.77,3.81 0 top
CHAIN_IN_2  64.77,11.43 0 top
CHAIN_OUT_1  64.77,93.98 0 top
CHAIN_OUT_2  64.77,90.17 0 top
CHAIN_OUT_3  64.77,86.36 0 top
CHIAN_IN_2  64.77,7.62 0 top
CLR_ROW_1  2.54,54.61 270 top
CLR_ROW_2  6.35,54.61 270 top
CLR_ROW_3  10.16,54.61 270 top
CLR_ROW_4  90.17,54.61 270 top
CLR_ROW_5  93.98,54.61 270 bottom
CLR_ROW_6  97.79,54.61 270 top
J1  48.26,5.08 180 top
J2  48.26,8.89 180 top
NANO_PINS_1  25.4,52.07 270 top
NANO_PINS_2  21.59,52.07 270 top
NANO_PWRS_1  50.8,52.07 270 top
NANO_PWRS_2  54.61,52.07 270 top
PWR_01  7.62,8.89 0 top
PWR_02  93.98,90.17 180 top
PWR_03  7.62,16.51 0 top
PWR_O4  6.35,92.71 0 top
Q01  66.04,74.93 90 top
Q02  74.93,74.93 90 top
Q03  83.82,74.93 90 top
Q04  16.51,58.42 90 top
Q05  30.48,58.42 90 top
Q06  41.91,58.42 90 top
Q07  66.04,57.15 90 top
Q08  74.93,57.15 90 top
Q09  83.82,57.15 90 top
Q10  66.04,41.91 90 top
Q11  74.93,41.91 90 top
Q12  83.82,41.91 90 top
Q13  66.04,25.4 90 top
Q14  74.93,25.4 90 top
Q15  83.82,25.4 90 top
Q16  90.17,17.78 0 top
Q17  90.17,11.43 0 top
Q18  90.17,5.08 0 top
R_01  60.96,76.2 90 top
R_02  71.12,76.2 90 top
R_03  80.01,76.2 90 top
R_04  22.86,59.69 90 top
R_05  35.56,59.69 90 top
R_06  48.26,59.69 90 top
R_07  60.96,58.42 90 top
R_08  71.12,58.42 90 top
R_09  80.01,58.42 90 top
R_10  60.96,43.18 90 top
R_11  71.12,43.18 90 top
R_12  80.01,43.18 90 top
R_13  60.96,29.21 90 top
R_14  71.12,29.21 90 top
R_15  80.01,29.21 90 top
R_16  86.36,16.51 90 top
TLC_OUTS_1  55.88,90.17 180 top
TLC_OUTS_2  55.88,93.98 180 top
U1  36.83,82.55 180 top
U$1  35.56,43.18 180 top

### Tracks (layer width: path | path; a pad name or v marks a point on that pad's centre or on a via)
5V  (via drill 0.35)
  Top 0.152: CHAIN_IN_1.2 CHIAN_IN_2.2 CHAIN_IN_2.2 67.25,11.5 67.25,12.25 57,22.5 57,42 54.75,44.25 NANO_PWRS_2.4 NANO_PWRS_1.4 U$1.5V 45.5,44.5 45.5,44.75 43.75,46.5 43.75,71.75 v43.5,72 | J2.12 J1.12 | CHAIN_OUT_1.2 CHAIN_OUT_2.2 CHAIN_OUT_3.2 | U1.21 35.75,78.5 36,78.25 36,77.25 39.25,74 39.25,73.75 10K.P$1
  Bottom 0.152: U1.21 35.75,78.75 39.75,82.75 50.25,82.75 52,84.5 65.25,84.5 67,86.25 67.25,86.25 CHAIN_OUT_3.2 | J1.12 20.5,5 23,2.5 65.25,2.5 66.5,3.75 67.25,3.75 CHAIN_IN_1.2 | v43.5,72 41,72 39.5,73.5 10K.P$1
12V  (via drill 0.35)
  Top 0.152: v43,62 42.95,61.95 42.58,61.95 42.39,62.13 41.43,62.13 41.24,61.95 v39.95,61.95 | v27.36,65 27.05,64.7 27.05,62.3 v27.36,62 | v87,75 v87,82
  Bottom 0.152: v39.95,61.95 40,62 37.06,62 R_05.P$2 34.34,63.5 33.17,62.33 30,62.33 29.31,63.02 29.31,63.05 v27.36,65 | v43,62 44.5,63.5 R_06.P$2 | v27.36,62 25.86,63.5 R_04.P$2 | R_02.P$2 69.9,80.01 68.73,81.18 65.56,81.18 64.39,80.01 R_01.P$2 | CLR_ROW_4.5 87,74.29 v87,75 | CLR_ROW_4.1 89.45,82 v87,82 82,82 R_03.P$2 | R_08.P$2 73.28,62.23 74.45,63.4 75.41,63.4 76.58,62.23 R_09.P$2 | R_11.P$2 73.28,46.99 74.45,48.16 75.41,48.16 76.58,46.99 R_12.P$2
  pour Top (no thermals): 0,100 100,100 100,0 0,0
BLANK
  Top 0.152: NANO_PINS_2.13 NANO_PINS_1.13 U$1.D10 30.5,21.75 33,24.25 33,56.75 42.75,66.5 42.75,76.5 40.75,78.5 U1.23 | CHAIN_IN_1.8 CHIAN_IN_2.8 CHAIN_IN_2.8 | CHAIN_OUT_3.8 CHAIN_OUT_2.8 CHAIN_OUT_1.8
  Bottom 0.152: U1.23 40.75,78.5 45.5,73.75 46.75,73.75 10K.P$2 47,73.75 47.5,73.75 48.25,74.5 49.5,74.5 49.5,79.5 52.25,82.25 78.5,82.25 82.5,86.25 CHAIN_OUT_3.8 | CHAIN_IN_2.8 82.5,11.5 81,13 77.25,13 76.25,12 76.25,10.25 74.25,10.25 73.75,10.75 73.75,12 70.75,15 38.75,15 32,21.75 30.5,21.75 U$1.D10
BTN_1
  Top 0.152: NANO_PWRS_2.12 NANO_PWRS_1.12 U$1.A0 45.5,24 45.5,23.75 43.75,22 43.75,10.75 45.5,9 J2.2 J1.2
BTN_2
  Top 0.152: NANO_PWRS_2.11 NANO_PWRS_1.11 U$1.A1 45.5,26.5 45.5,26.25 43.25,24 43.25,9 J2.3 J1.3
BTN_3
  Top 0.152: NANO_PWRS_2.10 NANO_PWRS_1.10 U$1.A2 45.5,29 45.5,28.75 42.75,26 42.75,11 J2.4 J1.4
BTN_4
  Top 0.152: NANO_PWRS_2.9 NANO_PWRS_1.9 U$1.A3 45.5,31.75 45.5,31.5 42.25,28.25 42.25,13 38.25,9 J2.5 J1.5
BTN_5
  Top 0.152: NANO_PWRS_2.8 NANO_PWRS_1.8 U$1.A4 45.5,34.25 45.5,34 41.75,30.25 41.75,19.25 37.75,15.25 37.75,11 37.67,11 J2.6 J1.6
BTN_6
  Top 0.152: NANO_PWRS_2.7 NANO_PWRS_1.7 U$1.A5 45.5,36.75 45.5,36.5 39.25,30.25 39.25,17.25 35.75,13.75 35.75,11.5 33.25,9 J2.7 J1.7
BTN_7
  Top 0.152: NANO_PWRS_2.6 NANO_PWRS_1.6 U$1.A6 45.5,39.25 45.5,39 38.5,32 38.5,19 37,17.5 37,15.5 30.5,9 J2.8 J1.8
BTN_8
  Top 0.152: NANO_PWRS_2.5 NANO_PWRS_1.5 U$1.A7 45.5,41.75 45.5,41.5 38,34 38,19 28,9 J2.9 J1.9
BTN_9  (via drill 0.35)
  Top 0.152: U$1.D7 NANO_PINS_1.10 NANO_PINS_2.10 21.5,29 21.5,28.75 19,26.25 v19,15.25 | J2.10 J1.10
  Bottom 0.152: v19,15.25 25.25,9 J2.10
BTN_10
  Top 0.152: U$1.D8 NANO_PINS_1.11 NANO_PINS_2.11 21.5,26.5 21.5,26.25 19.75,24.5 19.75,12 J2.11 J1.11
CLR_01
  Top 0.152: CLR_ROW_3.2 CLR_ROW_2.2 CLR_ROW_1.2 | CLR_ROW_4.2 CLR_ROW_5.2 CLR_ROW_6.2
  Bottom 0.152: 66.5,77.75 67.25,78.5 73.75,78.5 74,78.75 79,78.75 79.25,78.5 82.75,78.5 83,78.75 90,78.75 CLR_ROW_4.2 | 66.5,77.75 66.25,77.5 Q01.2 66.5,77.75 | 66.5,77.75 61,77.75 58.25,80.5 52,80.5 52,76.5 47.5,72 46.25,72 43,75.25 13.5,75.25 10.25,78.5 CLR_ROW_3.2
CLR_02
  Top 0.152: CLR_ROW_1.3 CLR_ROW_2.3 CLR_ROW_3.3 | CLR_ROW_6.3 CLR_ROW_5.3 CLR_ROW_4.3
  Bottom 0.152: CLR_ROW_4.3 90,76.25 76,76.25 75,77.25 Q02.2 74.75,77.25 73.75,77.25 67.25,70.75 60.5,70.75 60,71.25 15,71.25 10.25,76 CLR_ROW_3.3
CLR_05  (via drill 0.35)
  Top 0.152: CLR_ROW_1.7 CLR_ROW_2.7 CLR_ROW_3.7 | CLR_ROW_4.7 CLR_ROW_5.7 CLR_ROW_6.7 | v38.25,68.5 30.5,60.75 Q05.2
  Bottom 0.152: Q05.2 30.25,61 25.75,65.5 11.25,65.5 10.5,66.25 10.25,66.25 CLR_ROW_3.7 | v38.25,68.5 38.5,68.5 40,67 48.5,67 48.75,66.75 77.25,66.75 78,66 90,66 CLR_ROW_4.7
CLR_06
  Top 0.152: CLR_ROW_3.8 CLR_ROW_2.8 CLR_ROW_1.8 | CLR_ROW_6.8 CLR_ROW_5.8 CLR_ROW_4.8
  Bottom 0.152: 41.5,61.25 36.75,66 12.5,66 11.25,67.25 9.5,67.25 6.5,64.25 6.5,63.5 CLR_ROW_2.8 | 41.5,61.25 41.75,61 Q06.2 41.5,61.25 | 41.5,61.25 48.25,61.25 51.25,64.25 89.25,64.25 90,63.5 CLR_ROW_4.8
CLR_07
  Top 0.152: CLR_ROW_3.10 CLR_ROW_2.10 CLR_ROW_1.10 | CLR_ROW_4.10 CLR_ROW_5.10 CLR_ROW_6.10
  Bottom 0.152: CLR_ROW_4.10 90,58.5 89.75,58.5 84.5,63.75 70.25,63.75 66.25,59.75 Q07.2 66,59.75 11.5,59.75 10.25,58.5 CLR_ROW_3.10
CLR_08
  Top 0.152: CLR_ROW_1.11 CLR_ROW_2.11 CLR_ROW_3.11 | CLR_ROW_6.11 CLR_ROW_5.11 CLR_ROW_4.11
  Bottom 0.152: CLR_ROW_4.11 90,56 89.75,56 84.75,61 83,61 82.75,60.75 76,60.75 75,59.75 Q08.2 74.75,59.5 73.75,59.5 67.25,53 60.25,53 59.25,54 48,54 47.25,54.75 36.5,54.75 36,54.25 11.75,54.25 10.25,55.75 CLR_ROW_3.11
CLR_09
  Top 0.152: CLR_ROW_3.12 CLR_ROW_2.12 CLR_ROW_1.12 | CLR_ROW_4.12 CLR_ROW_5.12 CLR_ROW_6.12
  Bottom 0.152: CLR_ROW_4.12 90,53.5 84,59.5 Q09.2 83.75,59.5 80.5,56.25 76.25,56.25 72.5,52.5 56.5,52.5 55.5,53.5 42.5,53.5 41,52 33,52 31.25,53.75 11.25,53.75 11,53.5 10.25,53.5 CLR_ROW_3.12
CLR_10
  Top 0.152: CLR_ROW_3.14 CLR_ROW_2.14 CLR_ROW_1.14 | CLR_ROW_4.14 CLR_ROW_5.14 CLR_ROW_6.14
  Bottom 0.152: 66.5,44.75 70.25,48.5 90,48.5 CLR_ROW_4.14 | 66.5,44.75 66.25,44.5 Q10.2 66.5,44.75 | 66.5,44.75 61,44.75 60,45.75 12.75,45.75 10.25,48.25 CLR_ROW_3.14
CLR_11
  Top 0.152: CLR_ROW_1.15 CLR_ROW_2.15 CLR_ROW_3.15 | CLR_ROW_6.15 CLR_ROW_5.15 CLR_ROW_4.15
  Bottom 0.152: CLR_ROW_4.15 90,45.75 83,45.75 82.75,45.5 76,45.5 75,44.5 Q11.2 74.75,44.25 74.5,44.25 73.5,43.25 12.5,43.25 10.25,45.5 CLR_ROW_3.15
CLR_12
  Top 0.152: CLR_ROW_3.16 CLR_ROW_2.16 CLR_ROW_1.16 | CLR_ROW_4.16 CLR_ROW_5.16 CLR_ROW_6.16
  Bottom 0.152: CLR_ROW_4.16 90,43 85.25,43 84,44.25 Q12.2 83.75,44.25 80.25,40.75 76,40.75 73,37.75 56,37.75 55.75,38 16.25,38 11.25,43 10.25,43 CLR_ROW_3.16
CLR_13
  Top 0.152: CLR_ROW_1.18 CLR_ROW_2.18 CLR_ROW_3.18 | CLR_ROW_4.18 CLR_ROW_5.18 CLR_ROW_6.18
  Bottom 0.152: 66.5,28.25 69.75,31.5 74.25,31.5 80.75,38 90,38 CLR_ROW_4.18 | 66.5,28.25 66.25,28 Q13.2 66.5,28.25 | 66.5,28.25 64,28.25 56.75,35.5 12.75,35.5 10.25,38 CLR_ROW_3.18
CLR_14
  Top 0.152: CLR_ROW_3.19 CLR_ROW_2.19 CLR_ROW_1.19 | CLR_ROW_6.19 CLR_ROW_5.19 CLR_ROW_4.19
  Bottom 0.152: 75.5,28.5 78.5,31.5 83,31.5 87.25,35.75 90,35.75 CLR_ROW_4.19 | 75.5,28.5 75,28 Q14.2 75.5,28.5 | 75.5,28.5 72.25,28.5 70.5,26.75 65,26.75 58.75,33 12.75,33 10.25,35.5 CLR_ROW_3.19
CLR_15
  Top 0.152: CLR_ROW_1.20 CLR_ROW_2.20 CLR_ROW_3.20 | CLR_ROW_4.20 CLR_ROW_5.20 CLR_ROW_6.20
  Bottom 0.152: CLR_ROW_4.20 90,33 89.75,32.75 88.75,32.75 84,28 Q15.2 83.75,27.75 82.75,26.75 78.5,26.75 75.5,23.75 59.75,23.75 55.5,28 16,28 11,33 10.25,33 CLR_ROW_3.20
CLR_16  (via drill 0.35)
  Top 0.152: CLR_ROW_3.22 CLR_ROW_2.22 CLR_ROW_1.22 | CLR_ROW_6.22 CLR_ROW_5.22 CLR_ROW_4.22 | v85,9.25 87.75,12 87.75,13 92.5,17.75 Q16.2
  Bottom 0.152: Q16.2 92.5,18 92.5,27.25 93,27.25 93.5,27.75 93.75,27.75 CLR_ROW_5.22 | v85,9.25 49.75,9.25 45.75,13.25 22,13.25 14,21.25 9.75,21.25 8.5,22.5 8.5,27.25 9.25,27.25 9.75,27.75 10,27.75 CLR_ROW_3.22
CLR_17
  Top 0.152: CLR_ROW_1.23 CLR_ROW_2.23 CLR_ROW_3.23 | CLR_ROW_4.23 CLR_ROW_5.23 CLR_ROW_6.23
  Bottom 0.152: 88.5,18.75 88.5,24.75 89.25,24.75 89.75,25.25 90,25.25 CLR_ROW_4.23 | 88.5,18.75 88.5,15.5 92.5,11.5 Q17.2 | 88.5,18.75 85.75,18.75 84.25,20.25 39,20.25 33.75,25.5 10.25,25.5 CLR_ROW_3.23
CLR_18
  Top 0.152: CLR_ROW_3.24 CLR_ROW_2.24 CLR_ROW_1.24 | CLR_ROW_4.24 CLR_ROW_5.24 CLR_ROW_6.24 98,22.75 98,10.5 92.75,5.25 Q18.2
  Bottom 0.152: CLR_ROW_2.24 6.5,22.75 18.75,10.5 18.75,6.75 63.75,6.75 65,5.5 87.5,5.5 89.5,3.5 90.75,3.5 92.25,5 92.5,5 Q18.2
CLR_O3
  Top 0.152: CLR_ROW_1.4 CLR_ROW_2.4 CLR_ROW_3.4 16.25,79.75 16.25,94.5 18.25,96.5 88.5,96.5 88.5,75.5 90,74 90,73.75 CLR_ROW_4.4 CLR_ROW_5.4 CLR_ROW_6.4
CLR_O4  (via drill 0.35)
  Top 0.152: CLR_ROW_3.6 CLR_ROW_2.6 CLR_ROW_1.6 | CLR_ROW_6.6 CLR_ROW_5.6 CLR_ROW_4.6 90,68.75 v86.25,65 | v40.5,65.5 v38.75,67.25
  Bottom 0.152: v38.75,67.25 38.25,67.75 11,67.75 10.25,68.5 CLR_ROW_3.6 | v40.5,65.5 41,65 v86.25,65
GND  (via drill 0.35)
  Top 0.152: Q05.3 30.48,71.52 v30,72 | v39,65 v36,65 | Q01.3 61,85.05 v61,87 | v67,54 66.04,54.96 66.04,55.5 67.21,56.67 67.21,60.17 66.04,61.34 Q07.3 | CHAIN_IN_2.1 CHIAN_IN_2.1
  Bottom 0.152: v30,72 26,72 25.4,72.6 2K.P$1 | Q06.3 40.52,64.89 40.25,64.89 40.14,65 v39,65 | v36,65 35.67,64.67 35.08,64.67 33.91,63.5 Q05.3 | v61,87 64.13,87 CHAIN_OUT_3.1 | Q02.3 72.77,80.01 71.6,78.84 70.64,78.84 69.47,80.01 Q01.3 | v67,54 74.93,61.93 Q08.3
  pour Bottom (no thermals): 0,100 100,100 100,0 0,0
GS_CLK  (via drill 0.35)
  Top 0.152: NANO_PINS_2.6 NANO_PINS_1.6 U$1.D3 30.5,39.5 32.5,41.5 32.5,52.5 29,56 v29,66.75 29,77.5 28,78.5 U1.18 | CHAIN_IN_1.6 CHIAN_IN_2.6 CHAIN_IN_2.6 77.25,11.5 v77.25,65.75 77.25,86.25 CHAIN_OUT_3.6 CHAIN_OUT_2.6 CHAIN_OUT_1.6
  Bottom 0.152: v29,66.75 29.25,66.5 48.5,66.5 49.25,65.75 v77.25,65.75
N$1
  Top 0.152: U1.20 33.25,78.5 33.25,73.75 2K.P$2
N$3
  Top 0.152: U$1.3.3V 45.75,19 50.75,19 NANO_PWRS_1.14
  Bottom 0.152: NANO_PWRS_2.14 54.5,19.25 51,19.25 NANO_PWRS_1.14
N$4
  Top 0.152: NANO_PWRS_1.13 U$1.AREF
  Bottom 0.152: NANO_PWRS_2.13 54.5,21.5 51,21.5 NANO_PWRS_1.13
N$13
  Top 0.152: U$1.RST NANO_PWRS_1.3 NANO_PWRS_2.3
N$14
  Top 0.152: NANO_PINS_2.15 NANO_PINS_1.15 U$1.D12
N$16
  Top 0.152: U$1.RST1 NANO_PINS_1.3 NANO_PINS_2.3
N$19
  Top 0.152: NANO_PINS_2.2 NANO_PINS_1.2 U$1.RX1
N$20
  Top 0.152: U$1.D4 NANO_PINS_1.7 NANO_PINS_2.7
N$21
  Top 0.152: U$1.TX0 NANO_PINS_1.1 NANO_PINS_2.1
N$22
  Top 0.152: U$1.D2 NANO_PINS_1.5 NANO_PINS_2.5
PWM_01
  Top 0.152: TLC_OUTS_2.1 TLC_OUTS_1.1 55.88,80.01 54.61,78.74 U1.28
  Bottom 0.152: Q01.1 66,74.75 63.25,74.75 61,72.5 R_01.P$1 60.75,72.5 54.75,78.5 53.5,78.5 U1.28
PWM_02  (via drill 0.35)
  Top 0.152: U1.1 TLC_OUTS_1.2 TLC_OUTS_2.2 | v60,89.25 60,89 67.75,81.25 67.75,75.75 71,72.5 R_02.P$1
  Bottom 0.152: R_02.P$1 71.25,72.5 73.5,74.75 74.75,74.75 Q02.1 | v60,89.25 59.75,89 54.75,89 53.75,90 53.5,90 TLC_OUTS_1.2
PWM_03  (via drill 0.35)
  Top 0.152: TLC_OUTS_2.3 TLC_OUTS_1.3 U1.2 51,86.25 51,85.75 v55.25,81.5 | v78,79.5 78,74.5 80,72.5 R_03.P$1
  Bottom 0.152: R_03.P$1 80.25,72.5 82.5,74.75 83.75,74.75 Q03.1 | v78,79.5 76,81.5 v55.25,81.5
PWM_04  (via drill 0.35)
  Top 0.152: U1.3 TLC_OUTS_1.4 TLC_OUTS_2.4 | v30,83.25 26.75,80 26.75,60.75 23,57 23,56 R_04.P$1
  Bottom 0.152: Q04.1 16.75,58.25 19,56 22.75,56 R_04.P$1 | v30,83.25 49.5,83.25 49.5,85.25 48.5,86.25 U1.3
PWM_05  (via drill 0.35)
  Top 0.152: TLC_OUTS_2.5 TLC_OUTS_1.5 U1.4 45.75,86.25 47,86.25 47,76 45.25,74.25 v45.25,57
  Bottom 0.152: Q05.1 30.5,58.25 32.75,56 35.5,56 R_05.P$1 35.75,56 44.25,56 v45.25,57
PWM_06
  Top 0.152: TLC_OUTS_2.6 TLC_OUTS_1.6 U1.5 43.25,86.25 44.5,85 44.5,56.75 45.25,56 48.25,56 R_06.P$1
  Bottom 0.152: Q06.1 42,58.25 42.5,57.75 45.5,57.75 47.25,56 48.25,56 R_06.P$1
PWM_07  (via drill 0.35)
  Top 0.152: TLC_OUTS_2.7 TLC_OUTS_1.7 U1.6 | v48.75,84.25 52,81 52,63.75 v57.25,58.5
  Bottom 0.152: 61,54.75 63.25,57 66,57 Q07.1 | U1.6 42.75,84.25 v48.75,84.25 | 61,54.75 v57.25,58.5 | 61,54.75 R_07.P$1
PWM_08  (via drill 0.35)
  Top 0.152: U1.7 TLC_OUTS_1.8 TLC_OUTS_2.8 | v60,85.25 62.25,83 62.25,76.5 72.5,66.25 72.5,59.5 74.75,57.25 Q08.1
  Bottom 0.152: R_08.P$1 71.25,54.75 73.5,57 74.75,57 Q08.1 | v60,85.25 57.25,88 40.25,88 38.75,86.5 38.25,86.5 U1.7
PWM_09  (via drill 0.35)
  Top 0.152: TLC_OUTS_2.9 TLC_OUTS_1.9 U1.8 35.75,86.25 35.75,85.25 39.25,81.75 39.25,77.75 41.75,75.25 41.75,70.75 v42,70.5 | v82.75,66.75 82.25,66.25 82.25,58.75 83.75,57.25 Q09.1
  Bottom 0.152: R_09.P$1 80.25,54.75 82.5,57 83.75,57 Q09.1 | v82.75,66.75 79.25,70.25 42.25,70.25 v42,70.5
PWM_10  (via drill 0.35)
  Top 0.152: TLC_OUTS_2.10 TLC_OUTS_1.10 U1.9 33.25,86.25 36.75,82.75 36.75,77.75 39.25,75.25 41.25,75.25 v41.25,69 | v58.75,67.5 64.5,61.75 64.5,43.75 66,42.25 66,42 Q10.1
  Bottom 0.152: R_10.P$1 61,39.5 63.25,41.75 66,41.75 Q10.1 | v41.25,69 42.75,67.5 v58.75,67.5
PWM_11  (via drill 0.35)
  Top 0.152: TLC_OUTS_2.11 TLC_OUTS_1.11 U1.10 | v59.25,92.75 59.25,79 68.25,70 68.25,63.25 72.75,58.75 72.75,44 74.75,42 Q11.1
  Bottom 0.152: R_11.P$1 73.5,41.75 74.75,41.75 Q11.1 | v59.25,92.75 56.5,95.5 32.25,95.5 30.75,94 30.5,94 TLC_OUTS_2.11
PWM_12  (via drill 0.35)
  Top 0.152: TLC_OUTS_2.12 TLC_OUTS_1.12 U1.11 28,86.25 34.25,80 34.25,76 v40.5,69.75 | v81.75,66.75 81.75,54.25 81.25,53.75 81.25,44.5 83.75,42 Q12.1
  Bottom 0.152: R_12.P$1 80.25,39.5 82.5,41.75 83.75,41.75 Q12.1 | v81.75,66.75 78.75,69.75 v40.5,69.75
PWM_13
  Top 0.152: U1.12 TLC_OUTS_1.13 TLC_OUTS_2.13 25.5,94 25.5,95.5 56.5,95.5 57.5,94.5 57.5,89.75 58,89.25 58,28.25 60.75,25.5 R_13.P$1
  Bottom 0.152: R_13.P$1 61,25.5 66,25.5 Q13.1
PWM_14  (via drill 0.35)
  Top 0.152: U1.13 TLC_OUTS_1.14 TLC_OUTS_2.14 | Q14.1 74.75,25.5 71.25,25.5 R_14.P$1 71,25.5 67.75,28.75 67.75,70 58.5,79.25 v58.5,89.75
  Bottom 0.152: v58.5,89.75 56,92.25 24.75,92.25 23.25,93.75 23,93.75 TLC_OUTS_2.14
PWM_15
  Top 0.152: U1.14 TLC_OUTS_1.15 TLC_OUTS_2.15 20.5,94 20.5,96 82.25,96 85.5,92.75 85.5,27 84,25.5 Q15.1
  Bottom 0.152: R_15.P$1 80.25,25.5 83.75,25.5 Q15.1
PWM_16  (via drill 0.35)
  Top 0.152: TLC_OUTS_2.16 TLC_OUTS_1.16 17.78,80.01 19.05,78.74 U1.15 20.5,78.5 20.5,54.25 25.5,54.25 v26.75,53 | 89.25,15.5 89.5,15.75 89.5,17.25 90,17.75 Q16.1 | 89.25,15.5 86.5,12.75 R_16.P$1 | 89.25,15.5 81.5,23.25 81.5,43.75 78.75,46.5 78.75,49.75 v79,50
  Bottom 0.152: v79,50 78.25,50.75 42.5,50.75 41.25,49.5 33,49.5 31.75,50.75 29,50.75 v26.75,53
PWM_17  (via drill 0.35)
  Top 0.152: NANO_PINS_2.8 NANO_PINS_1.8 U$1.D5 30.5,34.5 32.5,32.5 32.5,25 v32.25,24.75
  Bottom 0.152: v32.25,24.75 39.25,17.75 83.75,17.75 90,11.5 Q17.1
PWM_18  (via drill 0.35)
  Top 0.152: NANO_PINS_2.9 NANO_PINS_1.9 U$1.D6 | v58.75,29.75 v71.5,17
  Bottom 0.152: Q18.1 86,9.25 86,11.25 85,11.25 79.25,17 v71.5,17 | v58.75,29.75 58,30.5 33.25,30.5 32,31.75 U$1.D6
S_CLK
  Top 0.152: CHAIN_IN_1.5 CHIAN_IN_2.5 CHAIN_IN_2.5 76.5,13 76.5,84 75,85.5 75,86.25 CHAIN_OUT_3.5 CHAIN_OUT_2.5 CHAIN_OUT_1.5 | U$1.D13 45.75,16.75 50.75,16.75 NANO_PWRS_1.15 51,16.75 54.5,16.75 NANO_PWRS_2.15
  Bottom 0.152: CHAIN_IN_2.5 74.75,11.5 69.5,16.75 54.75,16.75 NANO_PWRS_2.15 | U1.25 45.75,78.75 47.75,80.75 48.75,80.75 52,84 72.25,84 74.5,86.25 74.75,86.25 CHAIN_OUT_3.5
S_IN
  Top 0.152: NANO_PINS_2.14 NANO_PINS_1.14 U$1.D11 | CHAIN_IN_1.4 CHIAN_IN_2.4 CHAIN_IN_2.4 72.25,11.5 72.25,11.75 57.5,26.5 57.5,51 49.5,59 49.5,78.5 48.5,78.5 U1.26
  Bottom 0.152: U$1.D11 30.5,19 31.25,18.25 31.75,18.25 35.75,14.25 69.25,14.25 72,11.5 72.25,11.5 CHAIN_IN_2.4
S_OUT
  Top 0.152: CHAIN_OUT_3.4 CHAIN_OUT_2.4 CHAIN_OUT_1.4
  Bottom 0.152: U1.17 25.5,78.75 29.25,82.5 29.25,88.5 70.5,88.5 72,90 72.25,90 CHAIN_OUT_2.4
XLAT  (via drill 0.35)
  Top 0.152: NANO_PINS_2.12 NANO_PINS_1.12 U$1.D9 | CHAIN_IN_1.7 CHIAN_IN_2.7 CHAIN_IN_2.7 80,11.5 80,12.25 78.25,14 78.25,64.25 81.5,67.5 81.5,85 80.25,86.25 CHAIN_OUT_3.7 CHAIN_OUT_2.7 CHAIN_OUT_1.7 | v50.5,81.5 v48.5,81.5
  Bottom 0.152: v48.5,81.5 46,81.5 43.25,78.75 U1.24 | v50.5,81.5 52.25,83.25 76.5,83.25 79.5,86.25 80,86.25 CHAIN_OUT_3.7 | CHAIN_IN_2.7 80,11.25 78.5,9.75 49.75,9.75 45.75,13.75 35.75,13.75 31.75,17.75 29.75,17.75 27,20.5 27,24 25.5,24 NANO_PINS_1.12